# Altium schematic sheet Edge_Card_Connector.SchDoc
size A3
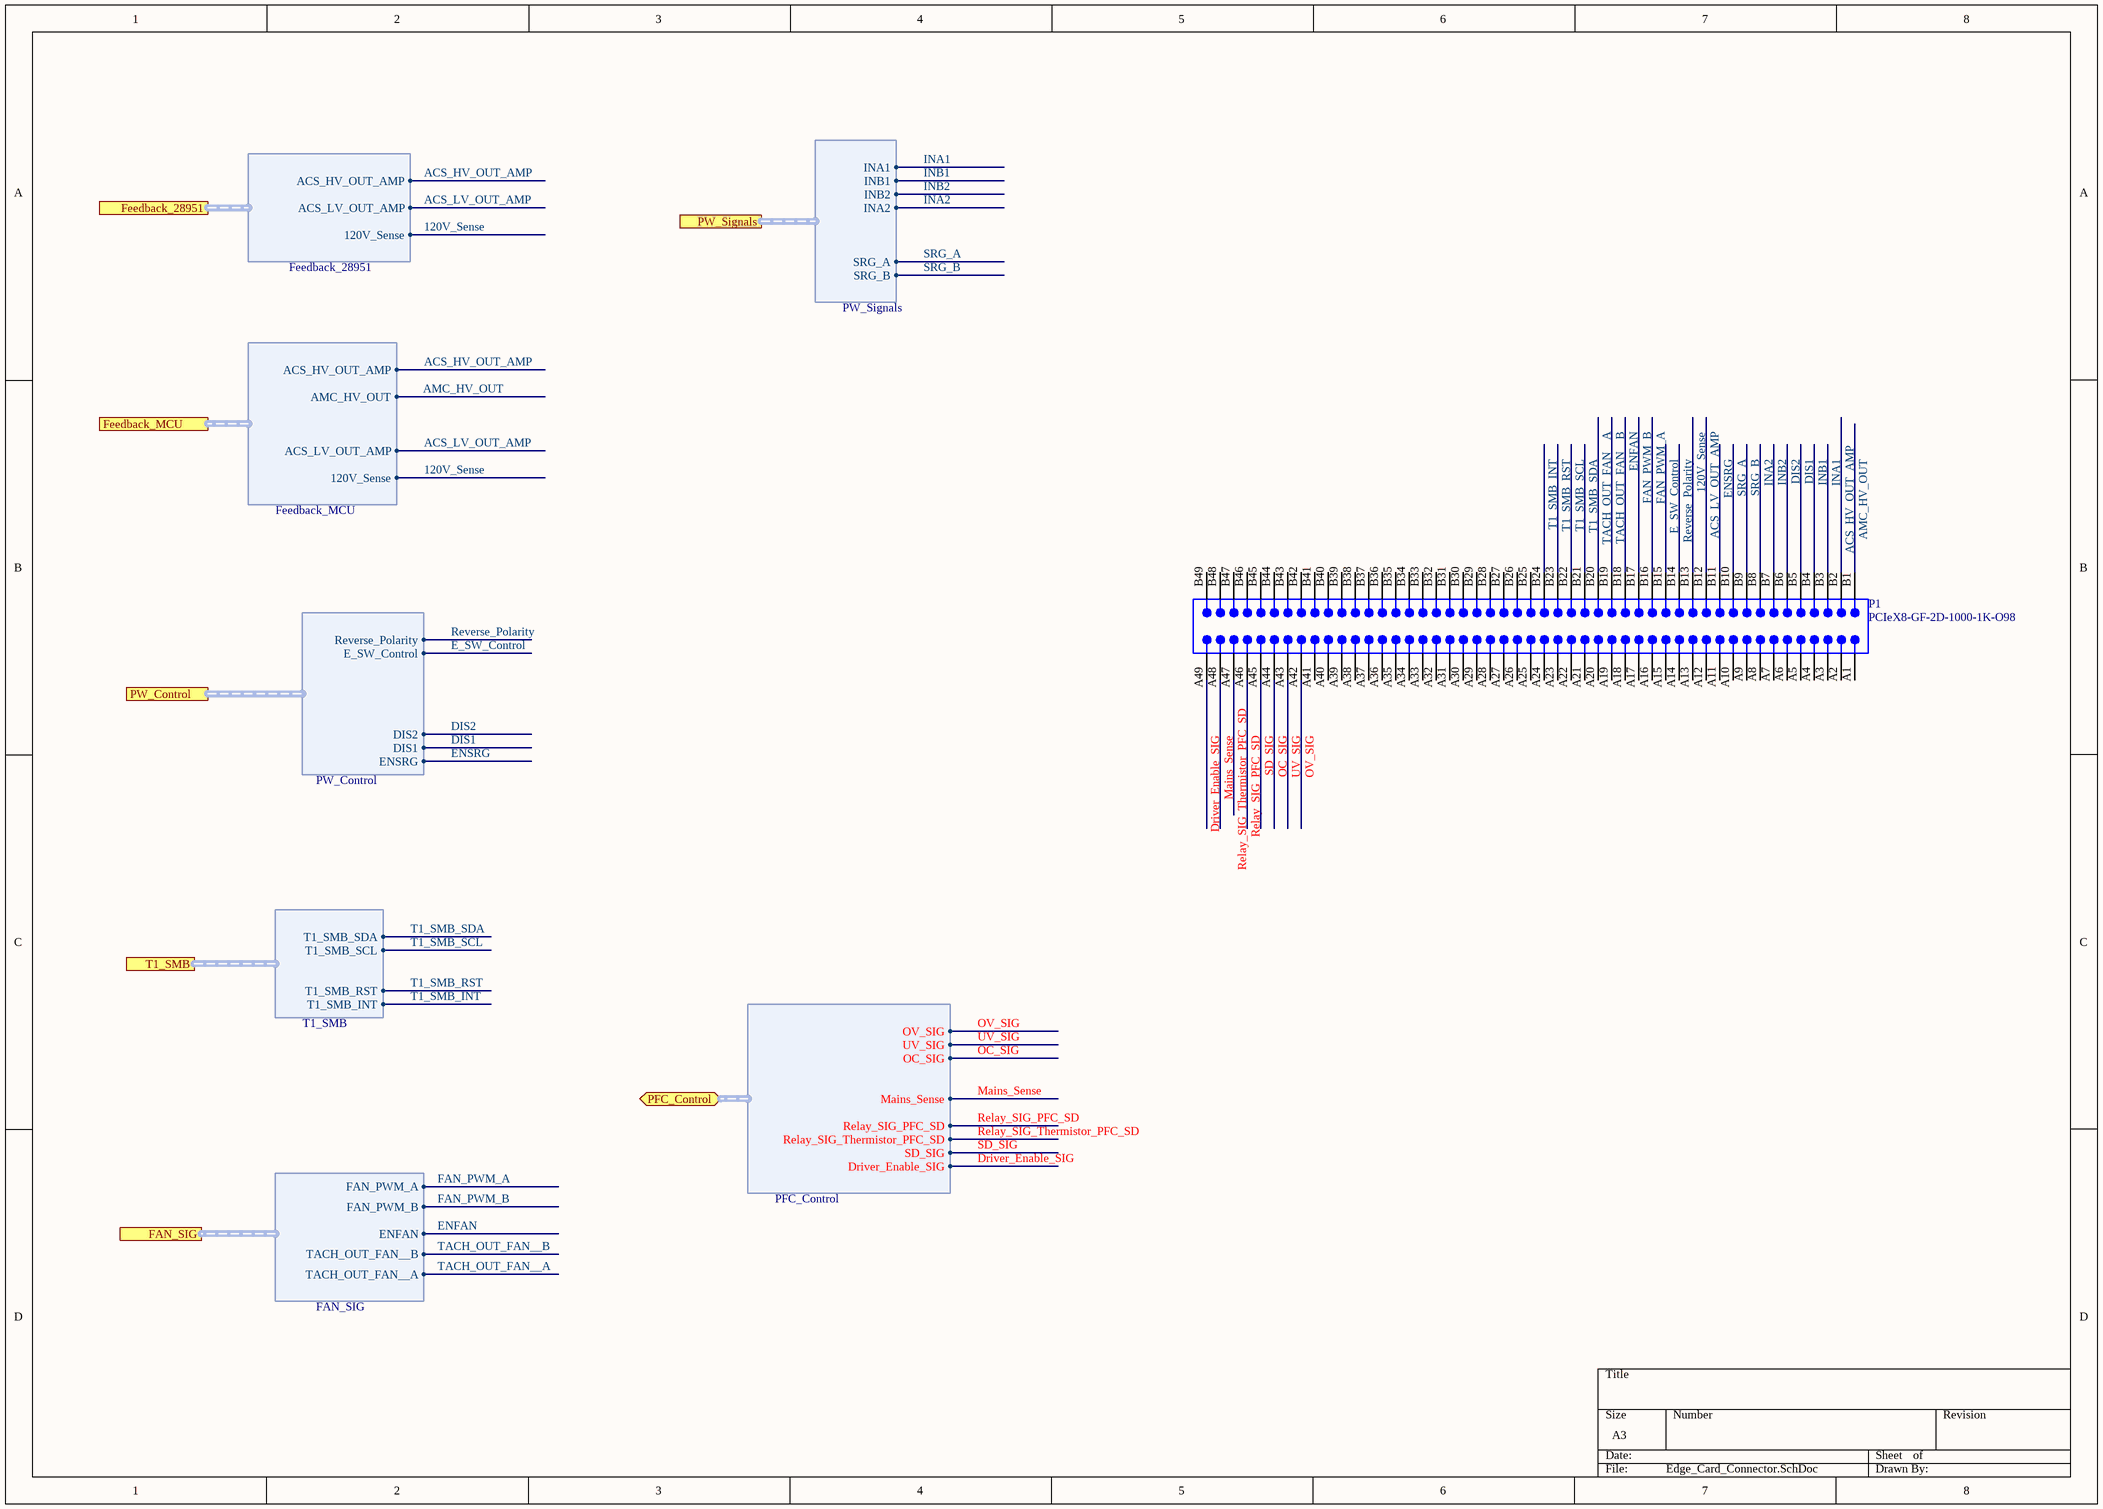
[diagram p0: Edge_Card_Connector.SchDoc]

## Parts
P1  PCIeX8-GF-2D-1000-1K-O98  [PCIeX8-GF-2D-1000-1K-O98]  (no BOM)

## Ports
FAN_SIG (harness FAN_SIG), Feedback_28951 (harness Feedback_28951), Feedback_MCU (harness Feedback_MCU), PFC_Control (bidir, harness PFC_Control), PW_Control (harness PW_Control), PW_Signals (harness PW_Signals), T1_SMB (harness T1_SMB)

## Harnesses
Feedback_28951: ACS_HV_OUT_AMP, 120V_Sense, ACS_LV_OUT_AMP
PW_Signals: INA1, INA2, INB1, INB2, SRG_A, SRG_B
Feedback_MCU: 120V_Sense, ACS_LV_OUT_AMP, ACS_HV_OUT_AMP, AMC_HV_OUT
PW_Control: E_SW_Control, Reverse_Polarity, DIS2, DIS1, ENSRG
FAN_SIG: ENFAN, FAN_PWM_A, FAN_PWM_B, TACH_OUT_FAN__A, TACH_OUT_FAN__B
T1_SMB: T1_SMB_INT, T1_SMB_RST, T1_SMB_SCL, T1_SMB_SDA
PFC_Control: Relay_SIG_Thermistor_PFC_SD, Mains_Sense, Driver_Enable_SIG, Relay_SIG_PFC_SD, UV_SIG, OV_SIG, SD_SIG, OC_SIG

## Nets
120V_Sense: P1.B13 ; port Feedback_28951.120V_Sense, port Feedback_MCU.120V_Sense
ACS_HV_OUT_AMP: P1.B2 ; port Feedback_28951.ACS_HV_OUT_AMP, port Feedback_MCU.ACS_HV_OUT_AMP
ACS_LV_OUT_AMP: P1.B12 ; port Feedback_28951.ACS_LV_OUT_AMP, port Feedback_MCU.ACS_LV_OUT_AMP
AMC_HV_OUT: P1.B1 ; port Feedback_MCU.AMC_HV_OUT
DIS1: P1.B5 ; port PW_Control.DIS1
DIS2: P1.B6 ; port PW_Control.DIS2
Driver_Enable_SIG: P1.A49 ; port PFC_Control.Driver_Enable_SIG
E_SW_Control: P1.B15 ; port PW_Control.E_SW_Control
ENFAN: P1.B18 ; port FAN_SIG.ENFAN
ENSRG: P1.B11 ; port PW_Control.ENSRG
FAN_PWM_A: P1.B16 ; port FAN_SIG.FAN_PWM_A
FAN_PWM_B: P1.B17 ; port FAN_SIG.FAN_PWM_B
INA1: P1.B3 ; port PW_Signals.INA1
INA2: P1.B8 ; port PW_Signals.INA2
INB1: P1.B4 ; port PW_Signals.INB1
INB2: P1.B7 ; port PW_Signals.INB2
Mains_Sense: P1.A48 ; port PFC_Control.Mains_Sense
OC_SIG: P1.A44 ; port PFC_Control.OC_SIG
OV_SIG: P1.A42 ; port PFC_Control.OV_SIG
Relay_SIG_PFC_SD: P1.A46 ; port PFC_Control.Relay_SIG_PFC_SD
Relay_SIG_Thermistor_PFC_SD: P1.A47 ; port PFC_Control.Relay_SIG_Thermistor_PFC_SD
Reverse_Polarity: P1.B14 ; port PW_Control.Reverse_Polarity
SD_SIG: P1.A45 ; port PFC_Control.SD_SIG
SRG_A: P1.B10 ; port PW_Signals.SRG_A
SRG_B: P1.B9 ; port PW_Signals.SRG_B
T1_SMB_INT: P1.B24 ; port T1_SMB.T1_SMB_INT
T1_SMB_RST: P1.B23 ; port T1_SMB.T1_SMB_RST
T1_SMB_SCL: P1.B22 ; port T1_SMB.T1_SMB_SCL
T1_SMB_SDA: P1.B21 ; port T1_SMB.T1_SMB_SDA
TACH_OUT_FAN__A: P1.B20 ; port FAN_SIG.TACH_OUT_FAN__A
TACH_OUT_FAN__B: P1.B19 ; port FAN_SIG.TACH_OUT_FAN__B
UV_SIG: P1.A43 ; port PFC_Control.UV_SIG

Not connected (* = marked no-connect by the designer): P1 A1 A2 A3 A4 A5 A6 A7 A8 A9 A10 A11 A12 A13 A14 A15 A16 A17 A18 A19 A20 A21 A22 A23 A24 A25 A26 A27 A28 A29 A30 A31 A32 A33 A34 A35 A36 A37 A38 A39 A40 A41 B25 B26 B27 B28 B29 B30 B31 B32 B33 B34 B35 B36 B37 B38 B39 B40 B41 B42 B43 B44 B45 B46 B47 B48 B49

## Library data of the parts
P1 = PCIeX8-GF-2D-1000-1K-O98: Golden finger, PCIeX8, Dual, Opposite, Pitch 1mm, 98-Position; Mating Connector: Molex-87715-9205; Package Version: rev2.0, Apr-2007; ClassName: Edge Connector; Package Reference: GF-2D-1000-1K-O98; Datasheet Version: rev2.0, Apr-2007; Publisher: Altium